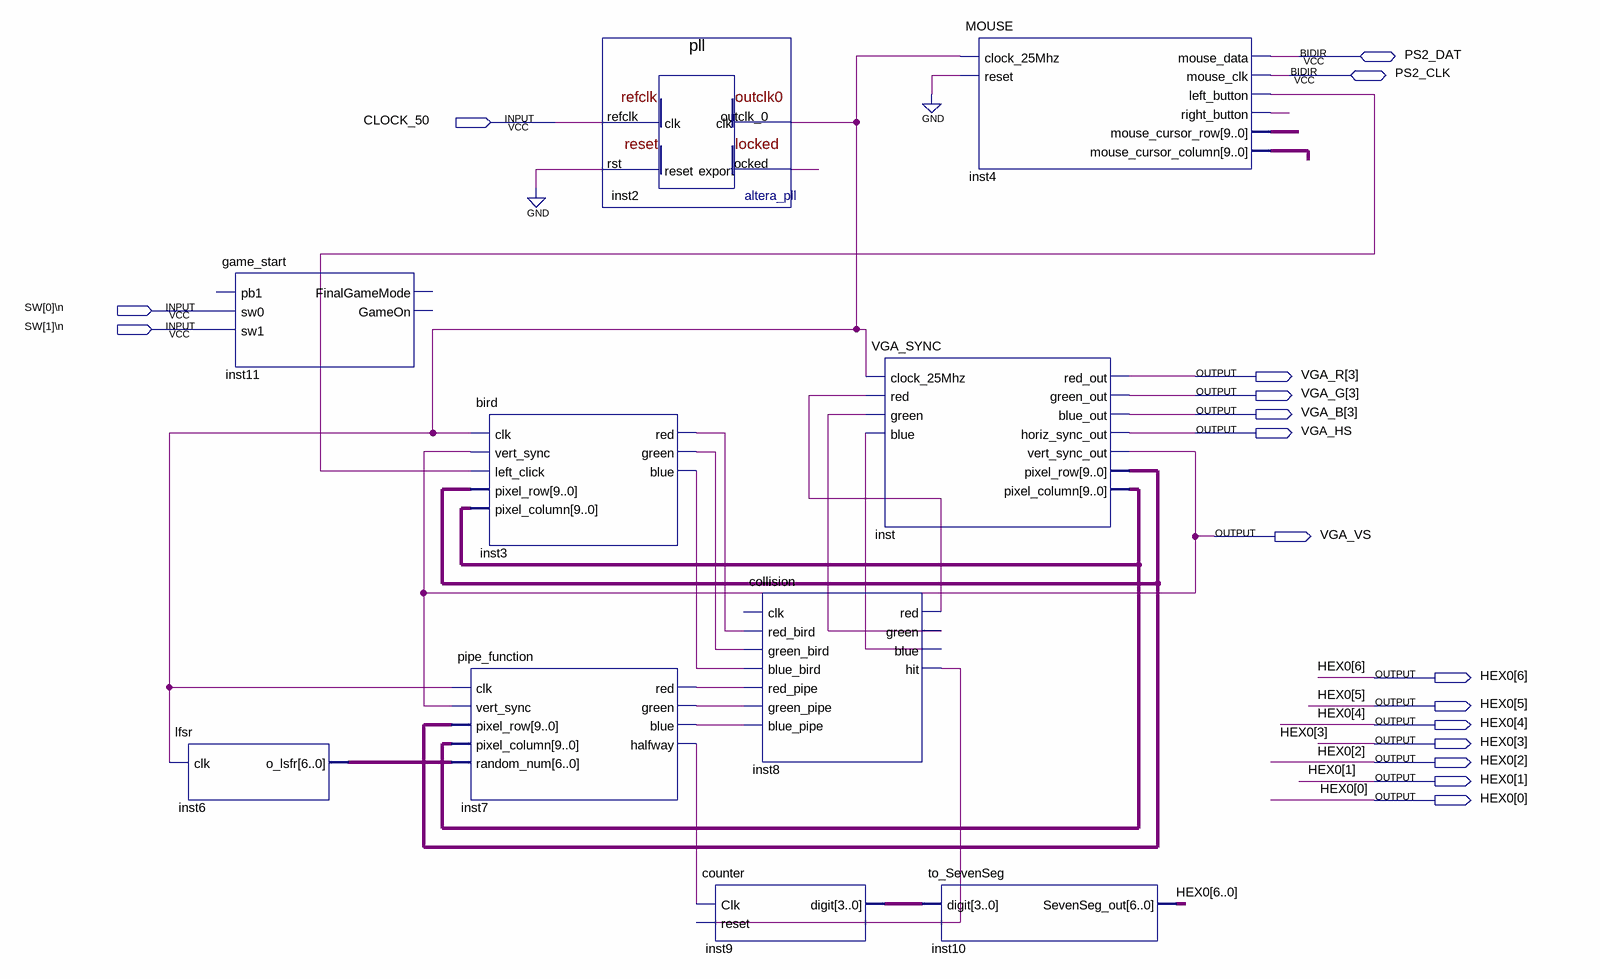
[diagram p0: schematic sheet]
// Quartus schematic main_connections.bdf as structural Verilog: 10 symbols, 17 pins
module main_connections (
  input  CLOCK_50,
  input  \SW[0]\n ,
  input  \SW[1]\n ,
  inout  PS2_DAT,
  inout  PS2_CLK,
  output [3:3] VGA_R,
  output [3:3] VGA_G,
  output [3:3] VGA_B,
  output VGA_HS,
  output VGA_VS,
  output [6:0] HEX0
);

  wire inst2_locked, inst2_outclk_0, inst3_blue, inst3_green, inst3_red, inst4_left_button,
       inst4_right_button, inst7_blue, inst7_green, inst7_halfway, inst7_red, inst8_blue, inst8_green,
       inst8_hit, inst8_red;
  wire [3:0] inst9_digit;
  wire [6:0] inst6_o_lsfr;
  wire [9:0] inst4_mouse_cursor_column, inst4_mouse_cursor_row, inst_pixel_column, inst_pixel_row;

  lfsr inst6 (.clk(inst2_outclk_0), .o_lsfr(inst6_o_lsfr));
  game_start inst11 (.sw0(\SW[0]\n ), .sw1(\SW[1]\n ));  // open: pb1, FinalGameMode, GameOn
  bird inst3 (
    .clk(inst2_outclk_0), .vert_sync(VGA_VS), .left_click(inst4_left_button), .pixel_row(inst_pixel_row),
    .pixel_column(inst_pixel_column), .red(inst3_red), .green(inst3_green), .blue(inst3_blue));
  pipe_function inst7 (
    .clk(inst2_outclk_0), .vert_sync(VGA_VS), .pixel_row(inst_pixel_row), .pixel_column(inst_pixel_column),
    .random_num(inst6_o_lsfr), .red(inst7_red), .green(inst7_green), .blue(inst7_blue),
    .halfway(inst7_halfway));
  pll inst2 (.refclk(CLOCK_50), .rst(1'b0), .outclk_0(inst2_outclk_0), .locked(inst2_locked));
  counter inst9 (.Clk(inst7_halfway), .reset(inst8_hit), .digit(inst9_digit));
  collision inst8 (
    .red_bird(inst3_red), .green_bird(inst3_green), .blue_bird(inst3_blue), .red_pipe(inst7_red),
    .green_pipe(inst7_green), .blue_pipe(inst7_blue), .red(inst8_red), .green(inst8_green),
    .blue(inst8_blue), .hit(inst8_hit));  // open: clk
  VGA_SYNC inst (
    .clock_25Mhz(inst2_outclk_0), .red(inst8_red), .green(inst8_green), .blue(inst8_blue),
    .red_out(VGA_R[3]), .green_out(VGA_G[3]), .blue_out(VGA_B[3]), .horiz_sync_out(VGA_HS),
    .vert_sync_out(VGA_VS), .pixel_row(inst_pixel_row), .pixel_column(inst_pixel_column));
  to_SevenSeg inst10 (.digit(inst9_digit), .SevenSeg_out(HEX0));
  MOUSE inst4 (
    .clock_25Mhz(inst2_outclk_0), .reset(1'b0), .left_button(inst4_left_button),
    .right_button(inst4_right_button), .mouse_cursor_row(inst4_mouse_cursor_row),
    .mouse_cursor_column(inst4_mouse_cursor_column), .mouse_data(PS2_DAT), .mouse_clk(PS2_CLK));
endmodule
